# Altium schematic sheet Power.SchDoc
size A; SheetNumber: 3; SheetTotal: 3
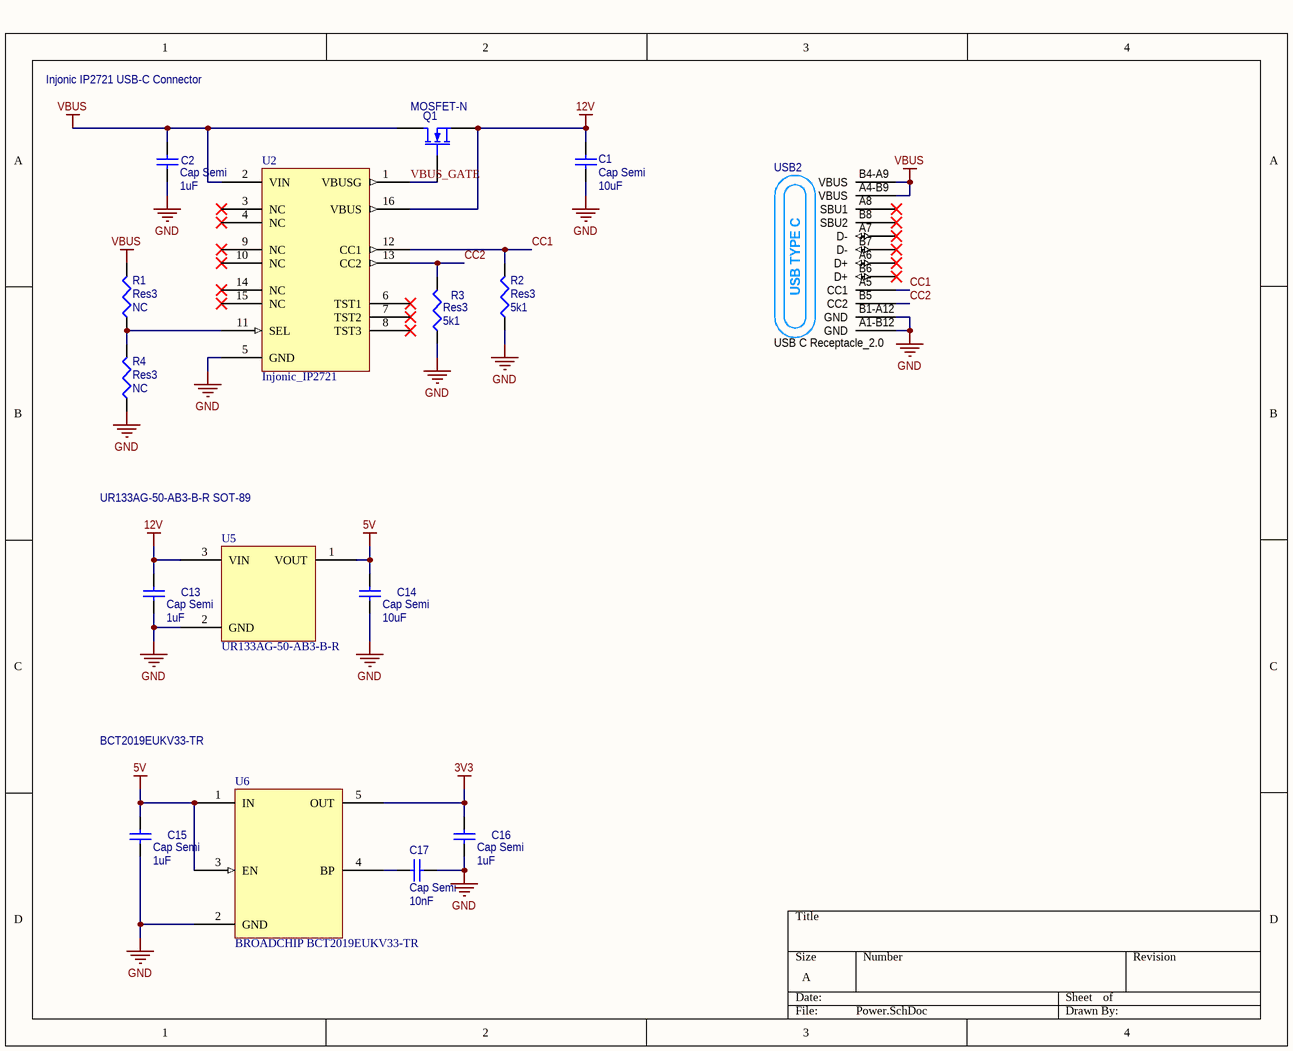
[diagram p0: Power.SchDoc]

## Parts
C1  Cap Semi  value 10uF  [1608[0603]]
C2  Cap Semi  value 1uF  [0402]
C13  Cap Semi  value 1uF  [0402]
C14  Cap Semi  value 10uF  [1608[0603]]
C15  Cap Semi  value 1uF  [0402]
C16  Cap Semi  value 1uF  [0402]
C17  Cap Semi  value 10nF  [0402]
Q1  MOSFET-N  [BSS214NWH6327]
R1  Res3  value NC  [J1-0603]
R2  Res3  value 5k1  [J1-0603]
R3  Res3  value 5k1  [J1-0603]
R4  Res3  value NC  [J1-0603]
U2  Injonic_IP2721  [TSOP65P640X120-16N]
U5  UR133AG-50-AB3-B-R  [SOT89-150P415X160-3N]
U6  BROADCHIP BCT2019EUKV33-TR  [SOT95P290X115-5N]
USB2  USB C Receptacle_2.0  [TYPE-C16PIN-CONNECTOR]

## Nets
3V3: C16.2 U6.5(OUT)
5V: C14.2 C15.2 U5.1(VOUT) U6.1(IN) U6.3(EN)
12V: C1.2 C13.2 Q1.3(S) U2.16(VBUS) U5.3(VIN)
GND: C1.1 C2.1 C13.1 C14.1 C15.1 C16.1 C17.1 R2.1 R3.1 R4.1 U2.5(GND) U5.2(GND) U6.2(GND) USB2.A1-B12(GND) USB2.B1-A12(GND)
VBUS: C2.2 Q1.1(D) R1.2 U2.2(VIN) USB2.A4-B9(VBUS) USB2.B4-A9(VBUS)
CC1: R2.2 U2.12(CC1) USB2.A5(CC1)
CC2: R3.2 U2.13(CC2) USB2.B5(CC2)
VBUS_GATE: Q1.2(G) U2.1(VBUSG)
NetC17_2: C17.2 U6.4(BP)
NetR1_1: R1.1 R4.2 U2.11(SEL)

Not connected (* = marked no-connect by the designer): U2 3(NC)* 4(NC)* 6(TST1)* 7(TST2)* 8(TST3)* 9(NC)* 10(NC)* 14(NC)* 15(NC)*; USB2 A6(D+)* A7(D-)* A8(SBU1)* B6(D+)* B7(D-)* B8(SBU2)*

## Notes on the sheet
- Injonic IP2721 USB-C Connector
- UR133AG-50-AB3-B-R SOT-89
- BCT2019EUKV33-TR
- (in symbol USB C Receptacle_2.0) USB TYPE C

## Library data of the parts
C1 C2 C13-C17 = Cap Semi: Capacitor (Semiconductor SIM Model); Published: 8-Jun-2000; LatestRevisionDate: 29-May-2009; LatestRevisionNote: IPC-7351 Footprint Added.; PackageReference: C1206; Publisher: Altium Limited; PackageDescription: Chip Capacitor
Q1 = MOSFET-N: N-Channel MOSFET; pin to pad: 1>3 2>1 3>2; Published: 8-Jun-2000; LatestRevisionDate: 17-Jul-2002; LatestRevisionNote: Re-released for DXP Platform.; PackageVersion: 1995/1996; PackageReference: E3; Publisher: Altium Limited; PackageDescription: TO, Flat Index; 3 In-Line, Axial Leads; Body Dia. 4.6mm; Lead Dia. 0.5 mm (max)
R1-R4 = Res3: Resistor; Published: 8-Jun-2000; LatestRevisionDate: 29-May-2009; LatestRevisionNote: IPC-7351 Footprint Added.; PackageReference: J1-0603; Publisher: Altium Limited; PackageDescription: Chip Resistor
U2 = Injonic_P2721: USB-C Controller
U5 = UR133AG-50-AB3-B-R SOT-89: 12V-5V Voltage Regulator
U6 = BCT2019EUKV33-TR: 5V-3.3V Voltage Regulator